# EasyEDA schematic Schematic.json
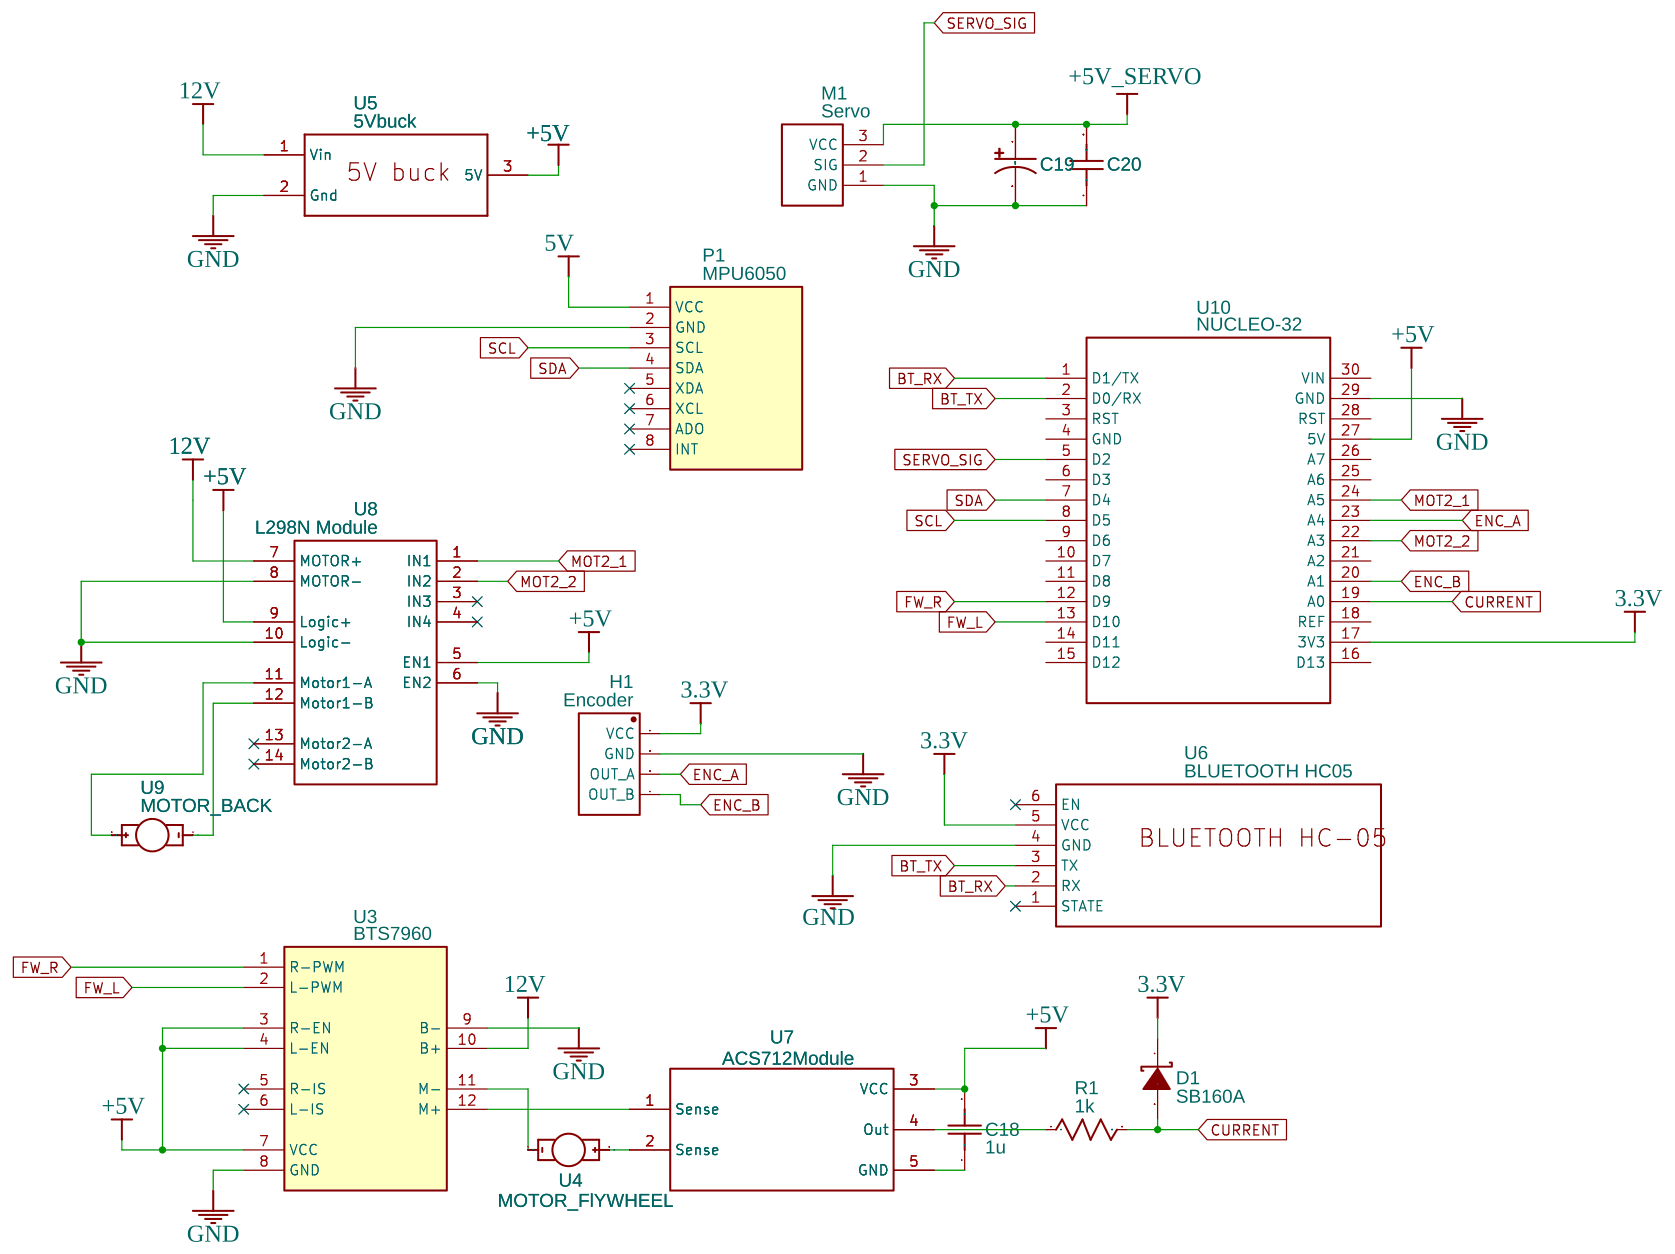
[diagram p0: schematic sheet]

## Parts
C18  1u  [RAD-0.1]
C19  1u  [CAP-D3.0XF1.5]
C20  1u  [RAD-0.1]
D1  SB160A  [DO-41_BD2.4-L4.7-P8.70-D0.9-RD]
H1  Encoder  [210S-1X4P]
M1  Servo  [SERVO]
P1  MPU6050  [MPU6050]
R1  1k  [AXIAL-0.3]
U3  BTS7960  [BTS7960]
U4  MOTOR_FlYWHEEL  [VIBE-MOTOR-10MM]
U5  5Vbuck
U6  BLUETOOTH HC05  [BLUETOOTH HC-05 PCB]
U7  ACS712Module
U8  L298N Module
U9  MOTOR_BACK  [VIBE-MOTOR-10MM]
U10  NUCLEO-32  [NUCLEO STM32F303K8 MINUCY]

## Library data of the parts
C18 C20 = Cap_RAD-0.1_US
C19 = Cap_Electrolytic(TH)_D3.0XF1.5_US
D1 = SB160A: Supplier: LCSC; Manufacturer: IR; Supplier Part: C15614
H1 = Header-Male-2.54_1x4: Supplier: LCSC; Manufacturer: Ckmtw; Manufacturer Part: 210S-1*4P L=11.6MMGold-plated black; Contributor: LCSC; Supplier Part: C124378
M1 = -: Manufacturer Part: New SchematicLib; Contributor: drwal.mateusz
P1 = -: sourceId: 1T5FDZYC8; Contributor: Fallegon
R1 = Res_AXIAL-0.3(1/8W)_US
U3 = -: Contributor: Rudiawan Edwin, M.Si, M.PKim
U4 U9 = -: Contributor: SparkFun
U5 = -: Contributor: pal.mark28
U6 = -: Contributor: khya
U7 = -: Manufacturer Part: AC712Module; Contributor: entityreborn
U8 = -: Contributor: stanpak
U10 = NUCLEO STM32F303K8 MINUCY: Contributor: suh.minu

## Nets
3.3V: D1.1(K) H1.1(VCC) U6.5(VCC) U10.17(3V3)
5V: P1.1(VCC)
12V: U3.10(B+) U5.1(Vin) U8.7(MOTOR+)
+5V: C18.2 U3.3(R-EN) U3.4(L-EN) U3.7(VCC) U5.3(5V) U7.3(VCC) U8.5(EN1) U8.9(Logic+) U10.27(5V)
+5V_SERVO: C19.1 C20.2 M1.3(VCC)
GND: C19.2 C20.1 H1.2(GND) M1.1(GND) P1.2(GND) U3.8(GND) U3.9(B-) U5.2(Gnd) U6.4(GND) U8.6(EN2) U8.8(MOTOR-) U8.10(Logic-) U10.29(GND)
BT_RX: U6.2(RX) U10.1(D1/TX)
BT_TX: U6.3(TX) U10.2(D0/RX)
CURRENT: D1.2(A) R1.2 U10.19(A0)
ENC_A: H1.3(OUT_A) U10.23(A4)
ENC_B: H1.4(OUT_B) U10.20(A1)
FW_L: U3.2(L-PWM) U10.13(D10)
FW_R: U3.1(R-PWM) U10.12(D9)
MOT2_1: U8.1(IN1) U10.24(A5)
MOT2_2: U8.2(IN2) U10.22(A3)
SCL: P1.3(SCL) U10.8(D5)
SDA: P1.4(SDA) U10.7(D4)
SERVO_SIG: M1.2(SIG) U10.5(D2)
Net-(C18-1): C18.1 U7.5(GND)
Net-(R1-1): R1.1 U7.4(Out)
Net-(U3-11): U3.11(M-) U4.-
Net-(U3-12): U3.12(M+) U7.1(Sense)
Net-(U4-+): U4.+ U7.2(Sense)
Net-(U8-11): U8.11(Motor1-A) U9.+
Net-(U8-12): U8.12(Motor1-B) U9.-

Not connected (* = marked no-connect by the designer): P1 5(XDA)* 6(XCL)* 7(ADO)* 8(INT)*; U3 5(R-IS)* 6(L-IS)*; U6 1(STATE)* 6(EN)*; U8 3(IN3)* 4(IN4)* 13(Motor2-A)* 14(Motor2-B)*; U10 3(RST) 4(GND) 6(D3) 9(D6) 10(D7) 11(D8) 14(D11) 15(D12) 16(D13) 18(REF) 21(A2) 25(A6) 26(A7) 28(RST) 30(VIN)
